# Altium project keyboard.PrjPcb
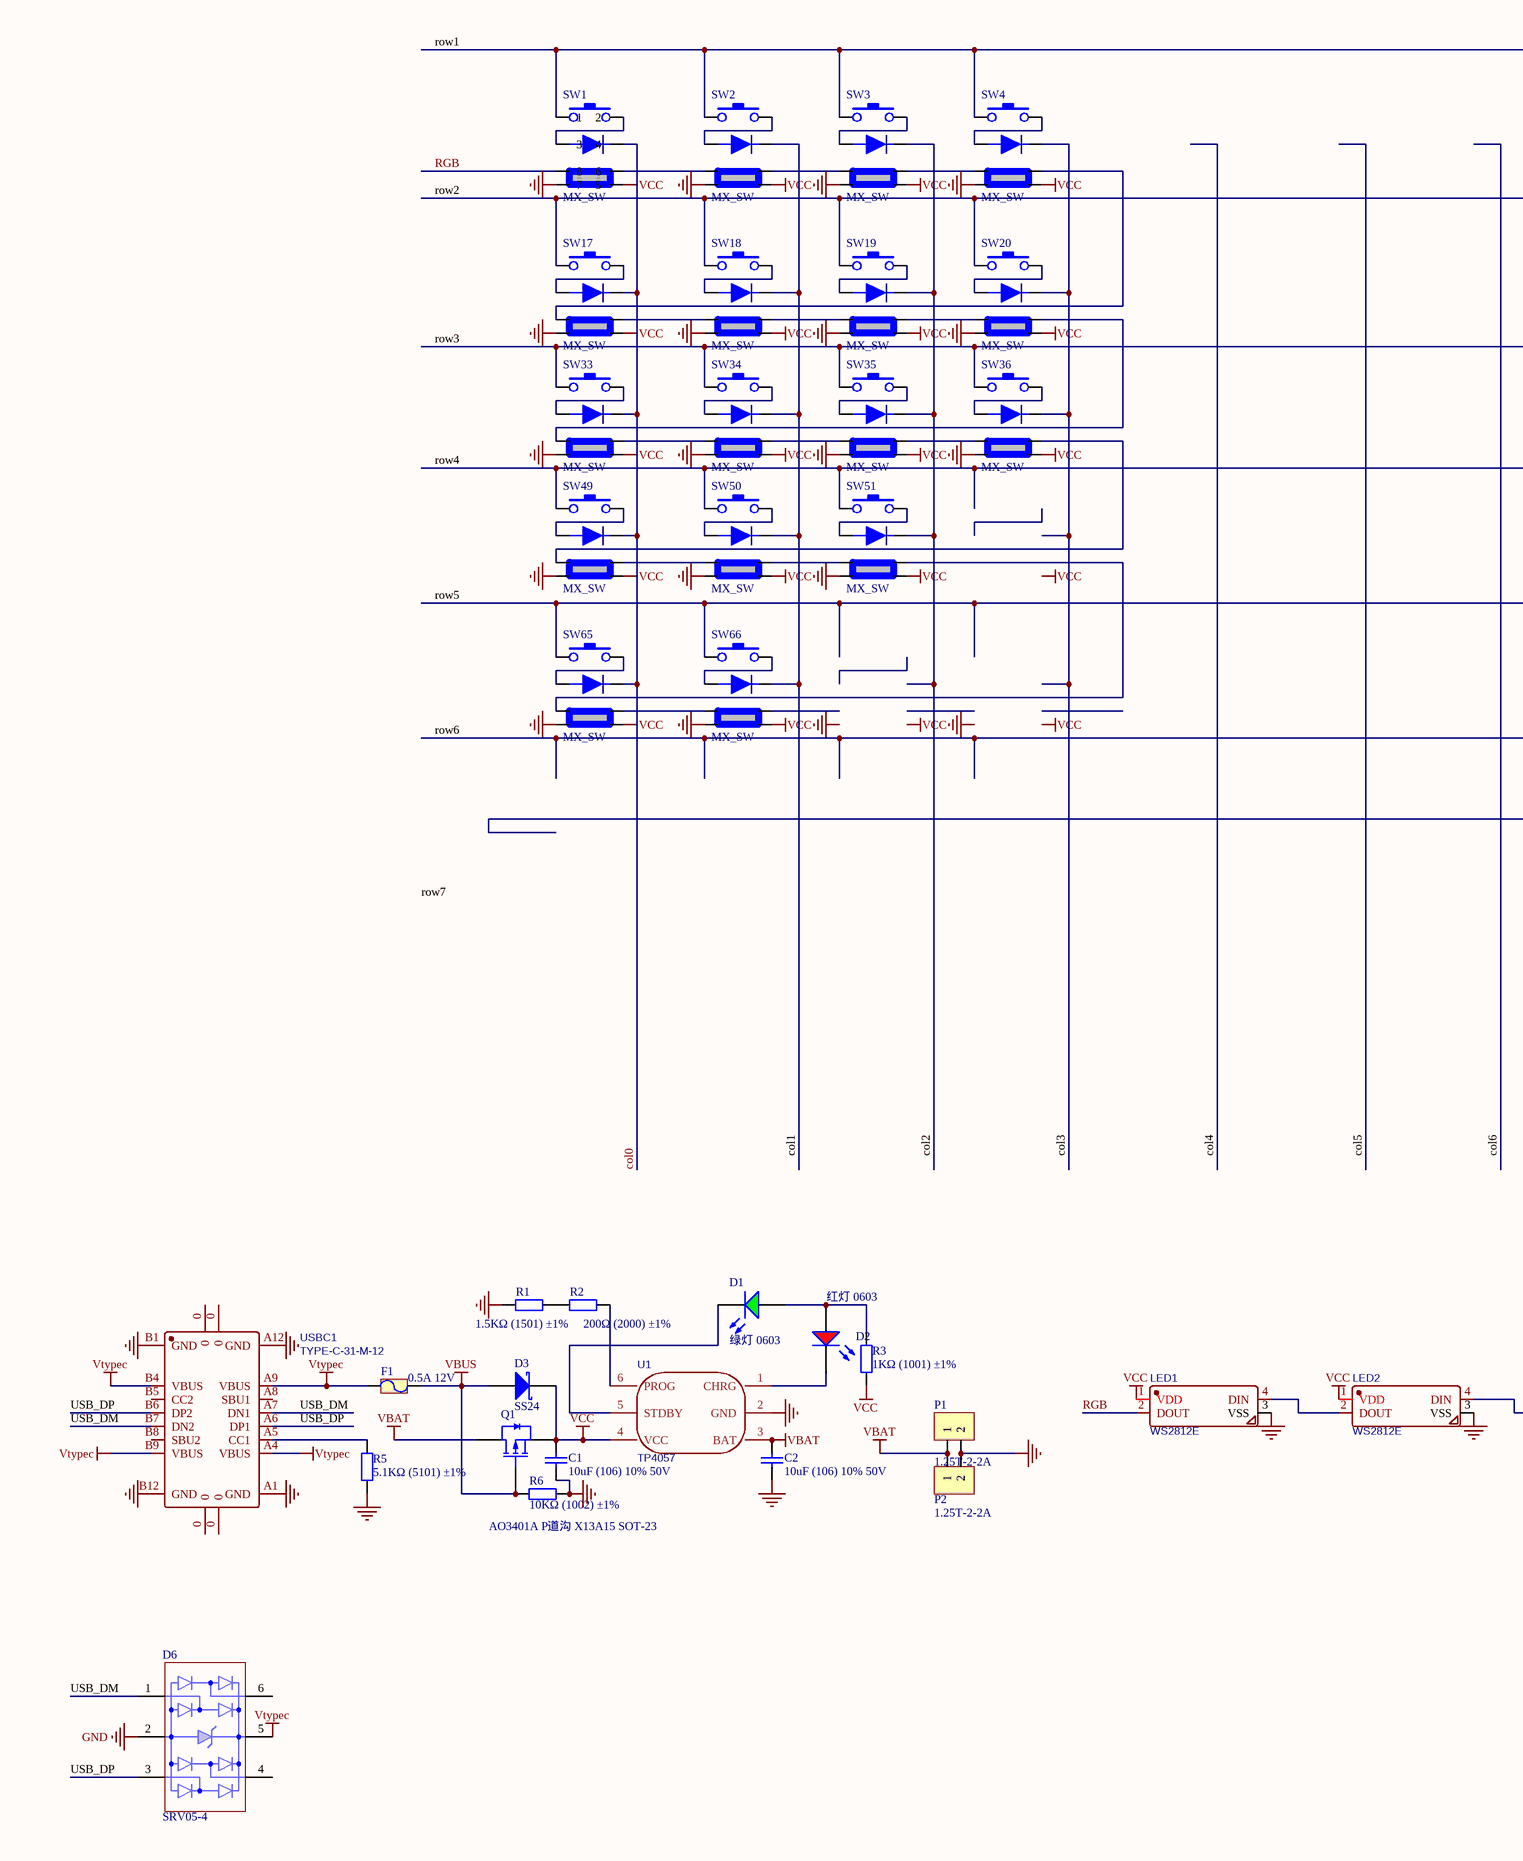
[diagram p0: keyboard.SchDoc, left]
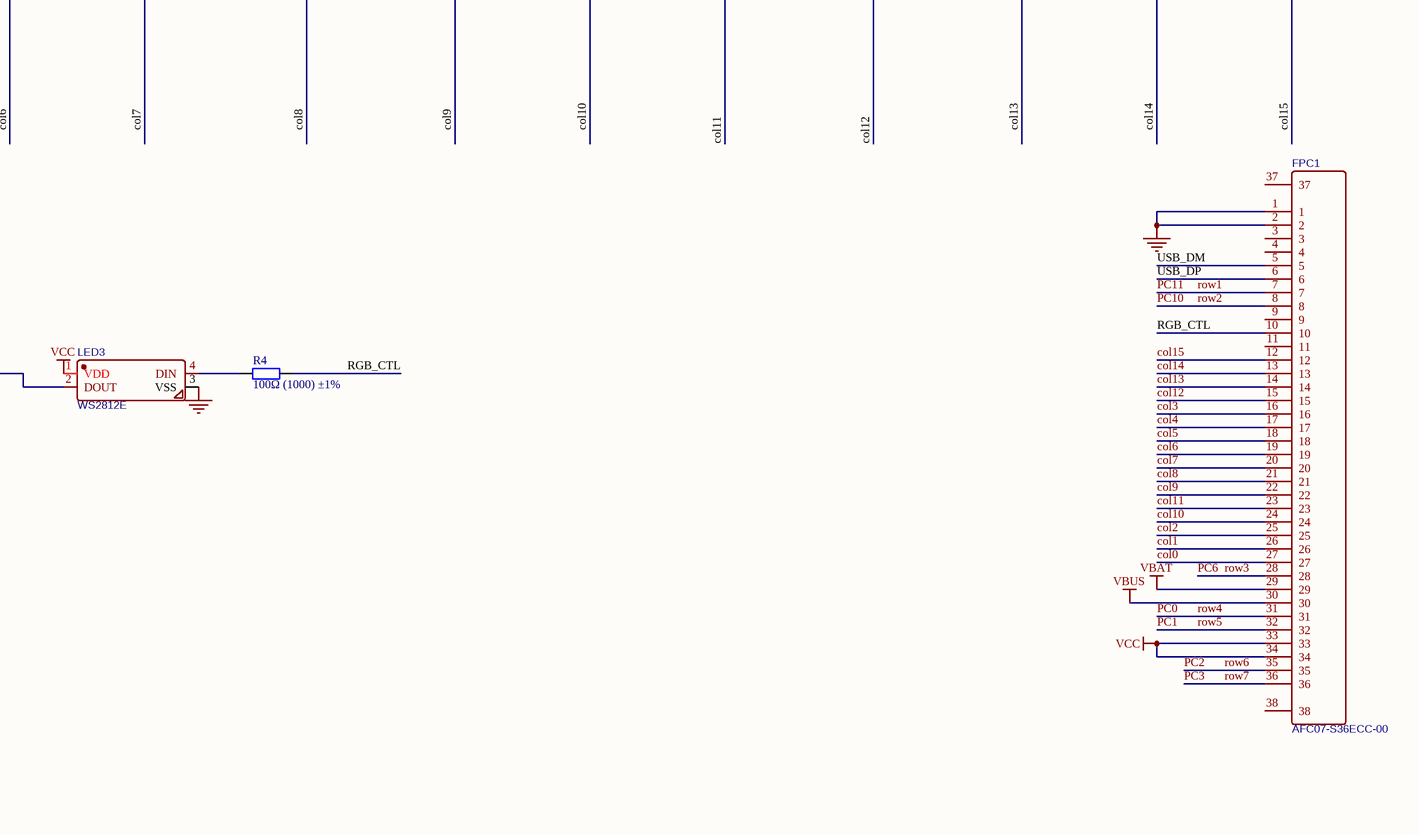
[diagram p1: keyboard.SchDoc, right]
1 sheet, 39 parts. Net scope: global (net labels, ports and power ports of the same name join across sheets).
Board file: keyboard.PcbDoc

## Sheet keyboard.SchDoc
size A2

### Parts
C1  10uF (106) 10% 50V  [1206_C]
C2  10uF (106) 10% 50V  [1206_C]
D1  绿灯 0603  [0603_LED_S1]
D2  红灯 0603  [0603_LED_S1]
D3  SS24  [SMB]
D6  SRV05-4  [SOT23-6]
F1  0.5A 12V  [R0805]
FPC1  AFC07-S36ECC-00  [FPC-0.5MM-36P-LCS-SJ-H2.0]
LED1  WS2812E  [LED-5050_4P]
LED2  WS2812E  [LED-5050_4P]
LED3  WS2812E  [LED-5050_4P]
P1  1.25T-2-2A  [PH_2PIN_1.25_T_90]
P2  1.25T-2-2A  [PH_2PIN_1.25_T_90]
Q1  AO3401A P道沟 X13A15 SOT-23  [SOT-23-3L]
R1  1.5KΩ (1501) ±1%  [0603_R]
R2  200Ω (2000) ±1%  [0603_R]
R3  1KΩ (1001) ±1%  [0603_R]
R4  100Ω (1000) ±1%  [0603_R]
R5  5.1KΩ (5101) ±1%  [0603_R]
R6  10KΩ (1002) ±1%  [0603_R]
SW1  MX_SW  [MX_SW-7]
SW2  MX_SW  [MX_SW-7]
SW3  MX_SW  [MX_SW-7]
SW4  MX_SW  [MX_SW-7]
SW17  MX_SW  [MX_SW-7]
SW18  MX_SW  [MX_SW-7]
SW19  MX_SW  [MX_SW-7]
SW20  MX_SW  [MX_SW-7]
SW33  MX_SW  [MX_SW-7]
SW34  MX_SW  [MX_SW-7]
SW35  MX_SW  [MX_SW-7]
SW36  MX_SW  [MX_SW-7]
SW49  MX_SW  [MX_SW-7]
SW50  MX_SW  [MX_SW-7]
SW51  MX_SW  [MX_SW-7]
SW65  MX_SW  [MX_SW-7]
SW66  MX_SW  [MX_SW-7]
U1  TP4057  [SOT-23-6]
USBC1  TYPE-C-31-M-12  [USB-TYPE-C_16PIN-MALE-TYPE-C-31-M-12]

### Nets
GND: C1.1 C2.1 D6.2 FPC1.1 FPC1.2 LED1.3(VSS) LED2.3(VSS) LED3.3(VSS) P1.2 P2.2 R1.1 R5.1 R6.1 SW1.7 SW2.7 SW3.7 SW4.7 SW17.7 SW18.7 SW19.7 SW20.7 SW33.7 SW34.7 SW35.7 SW36.7 SW49.7 SW50.7 SW51.7 SW65.7 SW66.7 U1.2(GND) USBC1.A1(GND) USBC1.A12(GND) USBC1.B1(GND) USBC1.B12(GND)
VBAT: C2.2 FPC1.29 P1.1 P2.1 Q1.3(D) U1.3(BAT)
VBUS: D3.1(A) F1.1 FPC1.30 Q1.1(G) R6.2
VCC: C1.2 D3.2(K) FPC1.33 FPC1.34 LED1.1(VDD) LED2.1(VDD) LED3.1(VDD) Q1.2(S) R3.1 SW1.5 SW2.5 SW3.5 SW4.5 SW17.5 SW18.5 SW19.5 SW20.5 SW33.5 SW34.5 SW35.5 SW36.5 SW49.5 SW50.5 SW51.5 SW65.5 SW66.5 U1.4(VCC)
Vtypec: D6.5 F1.2 USBC1.A4(VBUS) USBC1.A9(VBUS) USBC1.B4(VBUS) USBC1.B9(VBUS)
col0: FPC1.27 SW1.4 SW17.4 SW33.4 SW49.4 SW65.4
col1: FPC1.26 SW2.4 SW18.4 SW34.4 SW50.4 SW66.4
col2: FPC1.25 SW3.4 SW19.4 SW35.4 SW51.4
col3: FPC1.16 SW4.4 SW20.4 SW36.4
col4: FPC1.17
col5: FPC1.18
col6: FPC1.19
col7: FPC1.20
col8: FPC1.21
col9: FPC1.22
col10: FPC1.24
col11: FPC1.23
col12: FPC1.15
col13: FPC1.14
col14: FPC1.13
col15: FPC1.12
PC0: FPC1.31 SW49.1 SW50.1 SW51.1  [also labelled row4]
PC1: FPC1.32 SW65.1 SW66.1  [also labelled row5]
PC2: FPC1.35  [also labelled row6]
PC3: FPC1.36  [also labelled row7]
PC6: FPC1.28 SW33.1 SW34.1 SW35.1 SW36.1  [also labelled row3]
PC10: FPC1.8 SW17.1 SW18.1 SW19.1 SW20.1  [also labelled row2]
PC11: FPC1.7 SW1.1 SW2.1 SW3.1 SW4.1  [also labelled row1]
RGB: LED1.2(DOUT) SW1.8
RGB_CTL: FPC1.10 R4.2
USB_DM: D6.1 FPC1.5 USBC1.A7(DN1) USBC1.B7(DN2)
USB_DP: D6.3 FPC1.6 USBC1.A6(DP1) USBC1.B6(DP2)
NetD1_A: D1.A D2.A R3.2
NetD1_K: D1.K U1.5(STDBY)
NetD2_K: D2.K U1.1(CHRG)
NetLED1_4: LED1.4(DIN) LED2.2(DOUT)
NetLED2_4: LED2.4(DIN) LED3.2(DOUT)
NetLED3_4: LED3.4(DIN) R4.1
NetR1_2: R1.2 R2.1
NetR2_2: R2.2 U1.6(PROG)
NetR5_2: R5.2 USBC1.A5(CC1)
NetSW1_2: SW1.2 SW1.3
NetSW1_6: SW1.6 SW2.8
NetSW2_2: SW2.2 SW2.3
NetSW2_6: SW2.6 SW3.8
NetSW3_2: SW3.2 SW3.3
NetSW3_6: SW3.6 SW4.8
NetSW4_2: SW4.2 SW4.3
NetSW4_6: SW4.6 SW17.8
NetSW17_2: SW17.2 SW17.3
NetSW17_6: SW17.6 SW18.8
NetSW18_2: SW18.2 SW18.3
NetSW18_6: SW18.6 SW19.8
NetSW19_2: SW19.2 SW19.3
NetSW19_6: SW19.6 SW20.8
NetSW20_2: SW20.2 SW20.3
NetSW20_6: SW20.6 SW33.8
NetSW33_2: SW33.2 SW33.3
NetSW33_6: SW33.6 SW34.8
NetSW34_2: SW34.2 SW34.3
NetSW34_6: SW34.6 SW35.8
NetSW35_2: SW35.2 SW35.3
NetSW35_6: SW35.6 SW36.8
NetSW36_2: SW36.2 SW36.3
NetSW36_6: SW36.6 SW49.8
NetSW49_2: SW49.2 SW49.3
NetSW49_6: SW49.6 SW50.8
NetSW50_2: SW50.2 SW50.3
NetSW50_6: SW50.6 SW51.8
NetSW51_2: SW51.2 SW51.3
NetSW51_6: SW51.6 SW65.8
NetSW65_2: SW65.2 SW65.3
NetSW65_6: SW65.6 SW66.8
NetSW66_2: SW66.2 SW66.3

Not connected (* = marked no-connect by the designer): D6 4 6; FPC1 3 4 9 11 37 38; SW66 6; USBC1 0 A8(SBU1) B5(CC2) B8(SBU2)

### Notes on the sheet
- Labels drawn without touching a wire or pin: GND, row7, VCC

### Library data of the parts
C1 C2 = 1206 10uF (106) 10% 50V: 贴片电容; ComponentLink1Description: 供应商链接; ComponentLink1URL: http://www.szlcsc.com/product/details_14236.html; Package: 1206; Supplier: LC; SuppliersPartNumber: C13585
D1 = 0603 绿灯: 发光二极管; ComponentLink1Description: 供应商链接; ComponentLink1URL: http://www.szlcsc.com/product/details_73152.html; Package: 0603; Supplier: LC; SuppliersPartNumber: C72043
D2 = 0603 红灯: 发光二极管; ComponentLink1Description: 供应商链接; ComponentLink1URL: http://www.szlcsc.com/product/details_2659.html; Package: 0603; Supplier: LC; SuppliersPartNumber: C2286
D3 = SS24: 肖特基二极管; Manufacturer: VISHAY(威世); Part Number: RP02.06.000015; LatestRevisionDate: 09-Feb-2017; LatestRevisionNote: SCHlib build; Publisher: ChenYinaho; PackageDescription: SMB; Manufacturer Part Number: *; Value: SS24
D6 = SRV05-4: TVS阵列; Part Number: RP02.15.000006; LatestRevisionDate: 09-Feb-2017; LatestRevisionNote: SCHlib build; Publisher: ChenYinaho; PackageDescription: SOT23-6; Manufacturer: --; Manufacturer Part Number: SRV05-4; Value: SRV05-4
F1 = Fuse_500mA: 自恢复保险; Part Number: NEW; LatestRevisionDate: 09-Feb-2017; LatestRevisionNote: SCHlib build; Publisher: ChenYinaho; Manufacturer: *; Manufacturer Part Number: *; Value: 0.5A 12V
FPC1 = AFC07-S36ECC-00: BOM_Manufacturer: JUSHUO; Contributor: LCSC; BOM_Supplier: LCSC; BOM_Supplier Part: C262254; BOM_Manufacturer Part: AFC07-S36ECC-00; spicePre: F
LED1-LED3 = WS2812E: BOM_Manufacturer: Worldsemi; Contributor: LCSC; SMT Type: Extend; BOM_Supplier: LCSC; BOM_Supplier Part: C139127; BOM_Manufacturer Part: WS2812E; BOM_LCSC Assembly: Yes; spicePre: L
P1 P2 = CON2T_90_1: 卧贴座 1.25/2p; Part Number: RP02.07.000177; LatestRevisionDate: 09-Feb-2017; LatestRevisionNote: SCHlib build; Publisher: ChenYinaho; Manufacturer: *; Manufacturer Part Number: *; Value: 1.25T-2-2A
Q1 = AO3401A P道沟 X13A15 SOT-23: MOS(场效应管); ComponentLink1Description: 供应商链接; ComponentLink1URL: http://www.szlcsc.com/product/details_15801.html; Package: SOT-23; Supplier: LC; SuppliersPartNumber: C15127
R1 = 0603 1.5KΩ (1501) 1%: 贴片电阻; ComponentLink1Description: 供应商链接; ComponentLink1URL: http://www.szlcsc.com/product/details_23570.html; Package: 0603; Supplier: LC; SuppliersPartNumber: C22843
R2 = 0603 200Ω (2000) 1%: 贴片电阻; ComponentLink1Description: 供应商链接; ComponentLink1URL: http://www.szlcsc.com/product/details_8708.html; Package: 0603; Supplier: LC; SuppliersPartNumber: C8218
R3 = 0603 1KΩ (1001) 1%: 贴片电阻; ComponentLink1Description: 供应商链接; ComponentLink1URL: http://www.szlcsc.com/product/details_21904.html; Package: 0603; Supplier: LC; SuppliersPartNumber: C21190
R4 = 0603 100Ω (1000) 1%: 贴片电阻; ComponentLink1Description: 供应商链接; ComponentLink1URL: http://www.szlcsc.com/product/details_23502.html; Package: 0603; Supplier: LC; SuppliersPartNumber: C22775
R5 = 0603 5.1KΩ (5101) 1%: 贴片电阻; ComponentLink1Description: 供应商链接; ComponentLink1URL: http://www.szlcsc.com/product/details_23913.html; Package: 0603; Supplier: LC; SuppliersPartNumber: C23186
R6 = 0603 10KΩ (1002) 1%: 贴片电阻; ComponentLink1Description: 供应商链接; ComponentLink1URL: http://www.szlcsc.com/product/details_26547.html; Package: 0603; Supplier: LC; SuppliersPartNumber: C25804
SW1-SW4 SW17-SW20 SW33-SW36 SW49-SW51 SW65 SW66 = MX_SW-6: with Fixation pins  1-Pole w/Diode
U1 = TP4057: BOM_Manufacturer: TOPPOWER; SMT Type: Basic; BOM_Supplier: LCSC; BOM_Manufacturer Part: TP4057; BOM_LCSC Assembly: Yes; image: //image.lceda.cn/szlcsc/C12044.jpg; BOM_Supplier Part: C12044; spicePre: U
USBC1 = TYPE-C-31-M-12: BOM_Manufacturer: Rectangular Connectors - Contacts; Contributor: LCSC; BOM_Supplier: LCSC; BOM_Supplier Part: C165948; BOM_Manufacturer Part: TYPE-C-31-M-12; spicePre: U